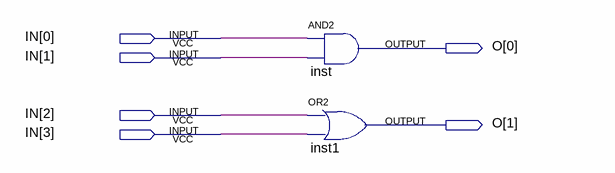
[diagram p0: schematic sheet]
// Quartus schematic test_a.bdf as structural Verilog: 2 symbols, 6 pins
module test_a (
  input  [3:0] IN,
  output [1:0] O
);

  and inst (O[0], IN[0], IN[1]);
  or inst1 (O[1], IN[2], IN[3]);
endmodule
